# Altium schematic sheet Main.SchDoc
size A4; SheetNumber: 1; SheetTotal: 5
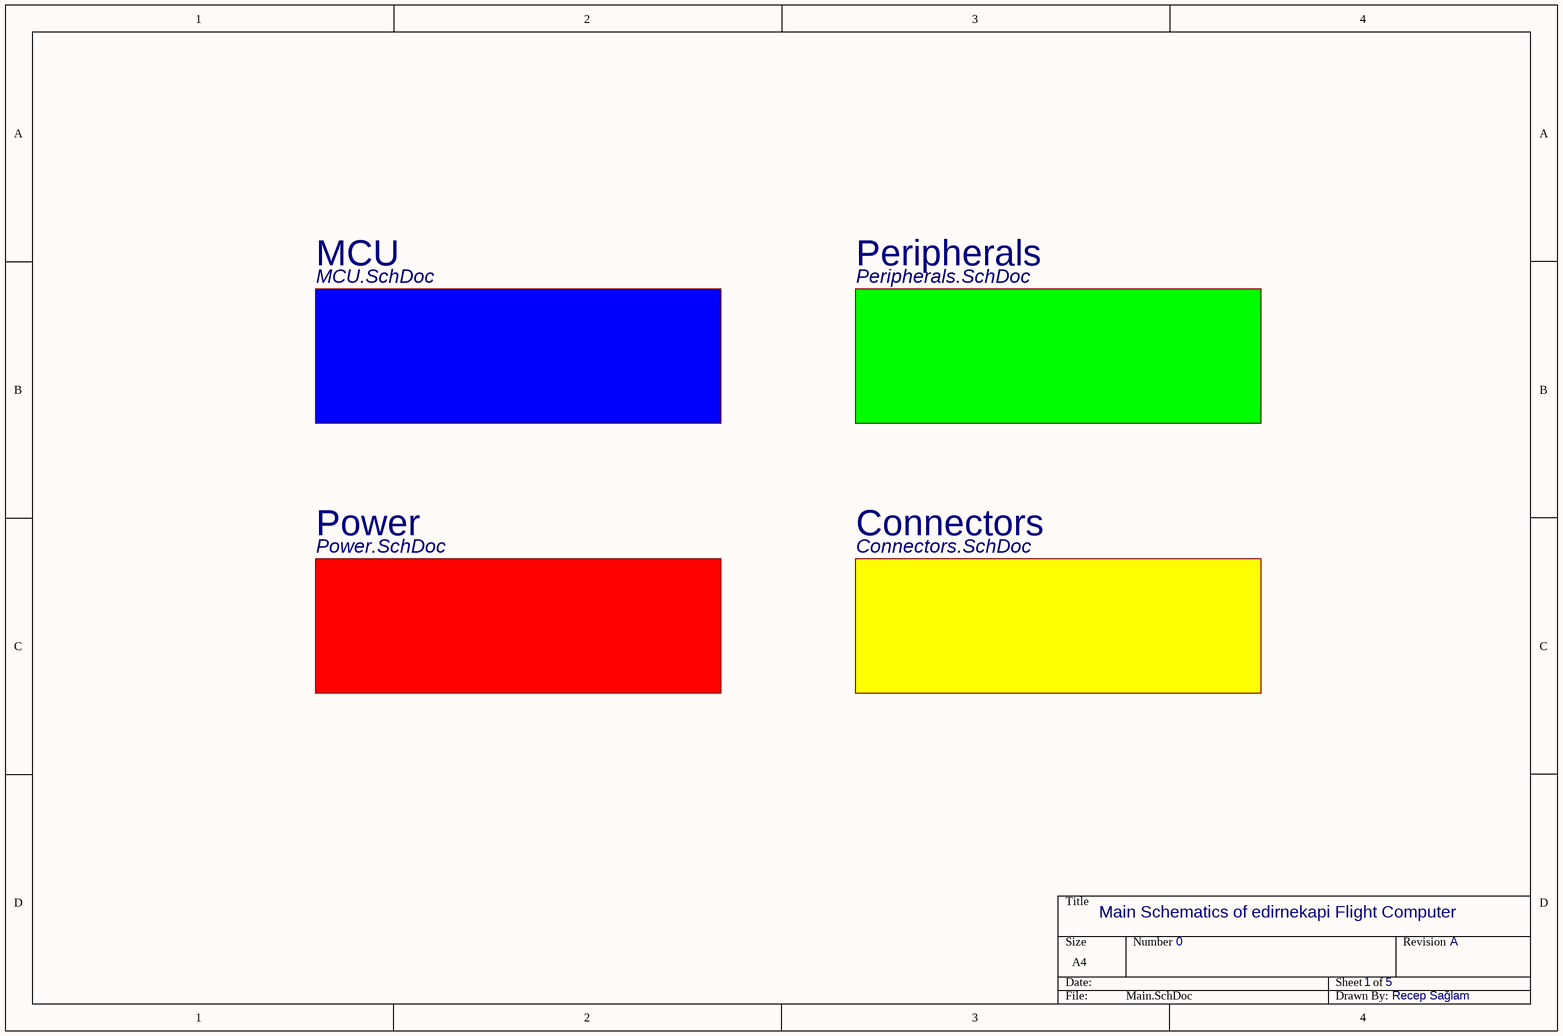
[diagram p0: Main.SchDoc]

## Sub-sheets
Connectors = Connectors.SchDoc: no entries
MCU = MCU.SchDoc: no entries
Peripherals = Peripherals.SchDoc: no entries
Power = Power.SchDoc: no entries

## Notes on the sheet
- Main Schematics of edirnekapi Flight Computer
- 0
- 1
- 5
- A
- Recep Sağlam